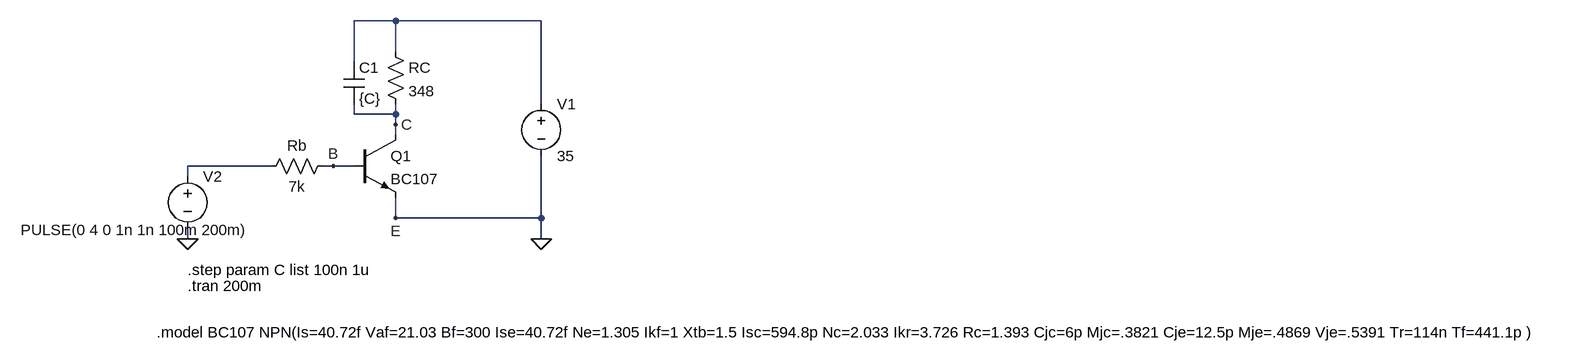
[diagram p0: schematic lab_2_1_2_switch_C_load_solution.asc]
lab_2_1_2_switch_C_load_solution.asc, the LTspice schematic file:
Version 4
SHEET 1 2632 680
WIRE 208 -80 144 -80
WIRE 432 -80 208 -80
WIRE 208 -32 208 -80
WIRE 144 -16 144 -80
WIRE 432 48 432 -80
WIRE 144 64 144 48
WIRE 208 64 208 48
WIRE 208 64 144 64
WIRE 208 80 208 64
WIRE 208 96 208 80
WIRE 16 144 -112 144
WIRE 112 144 96 144
WIRE 144 144 112 144
WIRE -112 160 -112 144
WIRE 208 224 208 192
WIRE 432 224 432 128
WIRE 432 224 208 224
WIRE -112 256 -112 240
WIRE 432 256 432 224
FLAG 432 256 0
FLAG -112 256 0
FLAG 208 80 C
FLAG 208 224 E
FLAG 112 144 B
SYMBOL npn 144 96 R0
SYMATTR InstName Q1
SYMATTR Value BC107
SYMBOL voltage 432 32 R0
WINDOW 123 0 0 Left 0
WINDOW 39 0 0 Left 0
SYMATTR InstName V1
SYMATTR Value 35
SYMBOL res 192 -48 R0
SYMATTR InstName RC
SYMATTR Value 348
SYMATTR SpiceLine tol=1 pwr=0.1
SYMBOL voltage -112 144 R0
WINDOW 3 -257 98 Left 2
WINDOW 123 0 0 Left 0
WINDOW 39 0 0 Left 0
SYMATTR Value PULSE(0 4 0 1n 1n 100m 200m)
SYMATTR InstName V2
SYMBOL res 112 128 R90
WINDOW 0 0 56 VBottom 2
WINDOW 3 32 56 VTop 2
SYMATTR InstName Rb
SYMATTR Value 7k
SYMATTR SpiceLine tol=1 pwr=0.1
SYMBOL cap 128 -16 R0
SYMATTR InstName C1
SYMATTR Value {C}
TEXT -112 304 Left 2 !.step param C list 100n 1u
TEXT -112 328 Left 2 !.tran 200m
TEXT -160 400 Left 2 !.model BC107 NPN(Is=40.72f Vaf=21.03 Bf=300 Ise=40.72f Ne=1.305 Ikf=1 Xtb=1.5 Isc=594.8p Nc=2.033 Ikr=3.726 Rc=1.393 Cjc=6p Mjc=.3821 Cje=12.5p Mje=.4869 Vje=.5391 Tr=114n Tf=441.1p )

The netlist it stands for:
* lab_2_1_2_switch_C_load_solution.asc
Q1 C B 0 0 BC107
V1 N001 0 35
RC N001 C 348 tol=1 pwr=0.1
V2 N002 0 PULSE(0 4 0 1n 1n 100m 200m)
Rb B N002 7k tol=1 pwr=0.1
C1 N001 C {C}
.model NPN NPN
.model PNP PNP
.lib standard.bjt
.step param C list 100n 1u
.tran 200m
.model BC107 NPN(Is=40.72f Vaf=21.03 Bf=300 Ise=40.72f Ne=1.305 Ikf=1 Xtb=1.5 Isc=594.8p Nc=2.033 Ikr=3.726 Rc=1.393 Cjc=6p Mjc=.3821 Cje=12.5p Mje=.4869 Vje=.5391 Tr=114n Tf=441.1p )
.backanno
.end